# Altium project YW_001.PrjPcb
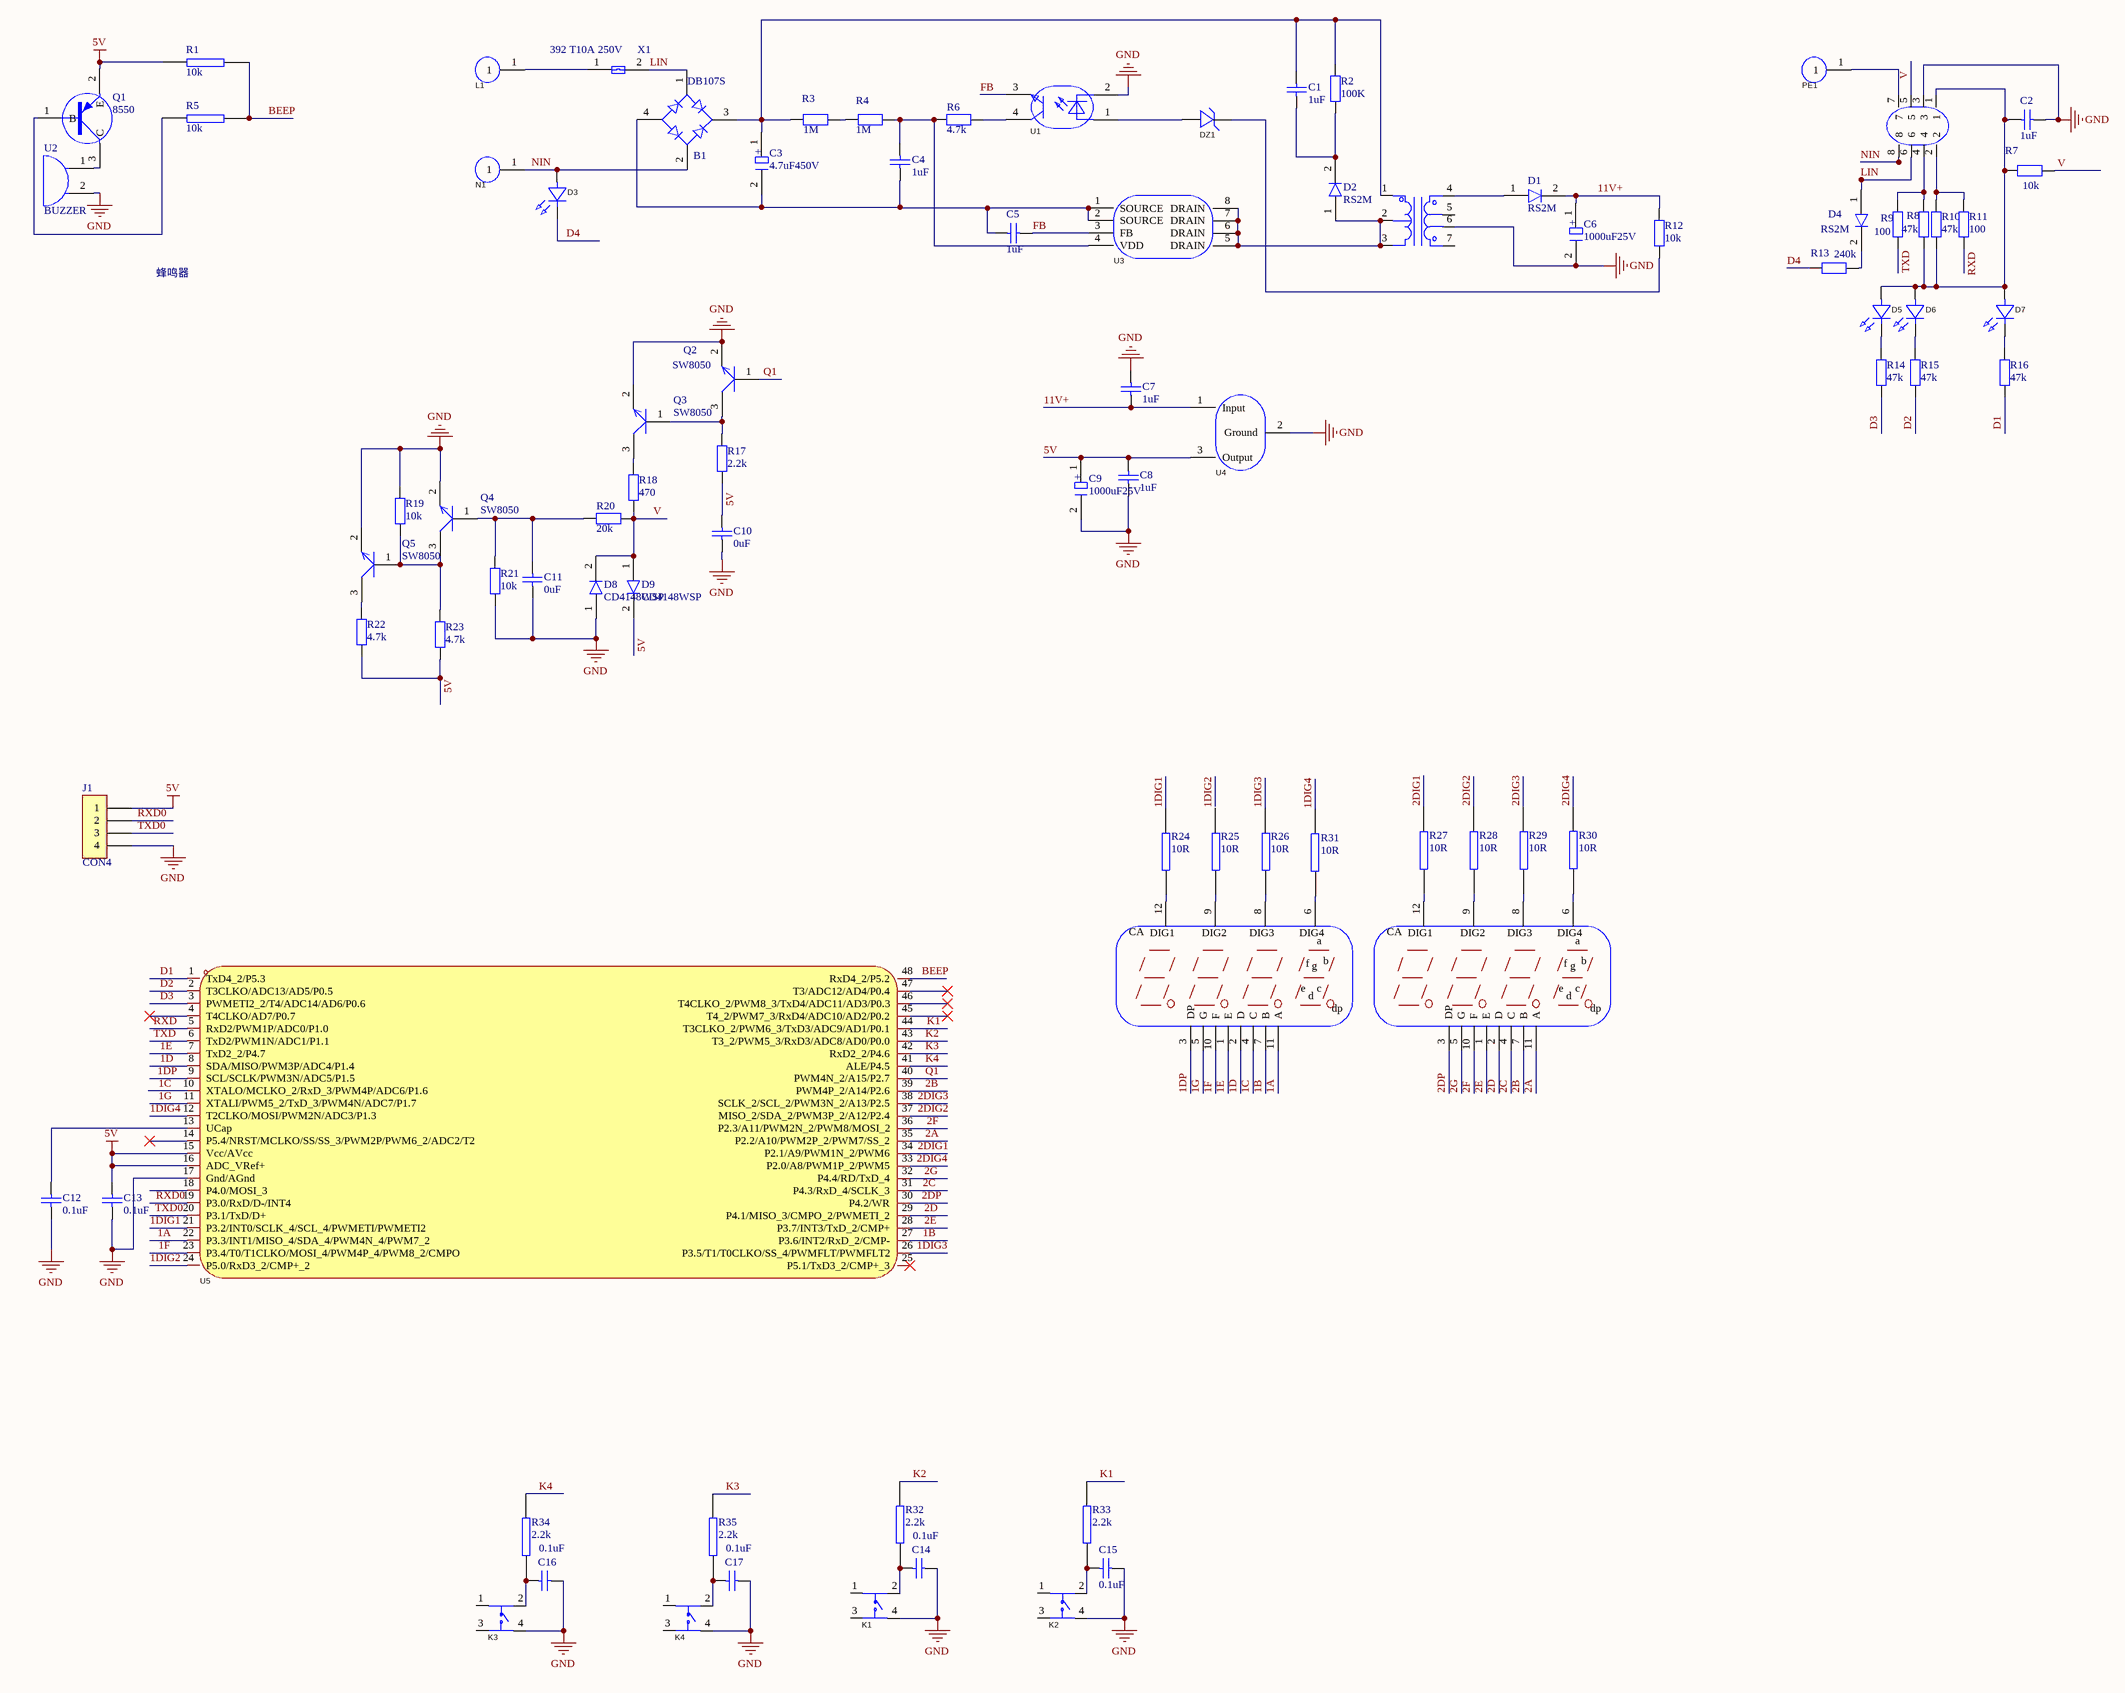
[diagram p0: YW_001.SchDoc]
1 sheet, 86 parts. Net scope: global (net labels, ports and power ports of the same name join across sheets).
Board file: YW_001.PcbDoc

## Sheet YW_001.SchDoc
size A1

### Parts
B1  DB107S  [DB107S]
C1  value 1uF  [CAP-TH_L5.5-W4.0-P5.00-D0.5]  (hidden comment: 102)
C2  value 1uF  [0805C]  (hidden comment: 104P)
C3  4.7uF450V  [CAP-TH_BD6.3-P2.50-D1.0-FD]
C4  1uF  [0805C]
C5  value 1uF  [0805C]  (hidden comment: 104P)
C6  1000uF25V  [CAP-TH_BD10.0-P5.00-D1.0-FD]
C7  value 1uF  [0805C]  (hidden comment: 102)
C8  1uF  [0805C]
C9  1000uF25V  [CAP-TH_BD10.0-P5.00-D1.0-FD]
C10  value 0uF  [0805C]  (hidden comment: 102)
C11  value 0uF  [0805C]  (hidden comment: 102)
C12  value 0.1uF  [C0603]  (hidden comment: 104P)
C13  value 0.1uF  [C0603]  (hidden comment: 104P)
C14  value 0.1uF  [0805C]  (hidden comment: 104P)
C15  value 0.1uF  [0805C]  (hidden comment: 104P)
C16  value 0.1uF  [0805C]  (hidden comment: 104P)
C17  value 0.1uF  [0805C]  (hidden comment: 104P)
D1  RS2M  [SMA-SMD_L4.4-W2.7-LS5.4-RD]
D2  RS2M  [SMA-SMD_L4.4-W2.7-LS5.4-RD]
D3  HLMP-1503-D0000  [LED-TH_BD3.0-P2.54-RD]  (value not drawn)
D4  RS2M  [SMA-SMD_L4.4-W2.7-LS5.4-RD]
D5  HLMP-1503-D0000  [LED-TH_BD3.0-P2.54-RD]  (value not drawn)
D6  HLMP-1503-D0000  [LED-TH_BD3.0-P2.54-RD]  (value not drawn)
D7  HLMP-1503-D0000  [LED-TH_BD3.0-P2.54-RD]  (value not drawn)
D8  CD4148WSP  [D0805-RD]
D9  CD4148WSP  [D0805-RD]
DZ1  ZMM24  [LL-34_L3.5-W1.5-RD]  (value not drawn)
H1  HC-5557-2*4AW  [CONN-TH_8P-P4.20_5557-2X4AW]  (value not drawn)
J1  CON4  [HDR1X4]
K1  TS1212TPFS 250gf 072  [KEY-SMD_4P-L12.0-W12.0-P5.00-LS15.0]  (value not drawn)
K2  TS1212TPFS 250gf 072  [KEY-SMD_4P-L12.0-W12.0-P5.00-LS15.0]  (value not drawn)
K3  TS1212TPFS 250gf 072  [KEY-SMD_4P-L12.0-W12.0-P5.00-LS15.0]  (value not drawn)
K4  TS1212TPFS 250gf 072  [KEY-SMD_4P-L12.0-W12.0-P5.00-LS15.0]  (value not drawn)
L1  PZ254V-11-01P  [HDR-TH_1P-P2.54-V-M]  (value not drawn)
LED1  FJ5461BH 橙红  [LED-SEG-TH_FJ5461AH]  (value not drawn)
LED2  FJ5461BH 橙红  [LED-SEG-TH_FJ5461AH]  (value not drawn)
N1  PZ254V-11-01P  [HDR-TH_1P-P2.54-V-M]  (value not drawn)
PE1  PZ254V-11-01P  [HDR-TH_1P-P2.54-V-M]  (value not drawn)
Q1  8550  [SOT-23]
Q2  SW8050  [SOT-23 - S8550]
Q3  SW8050  [SOT-23 - S8550]
Q4  SW8050  [SOT-23 - S8550]
Q5  SW8050  [SOT-23 - S8550]
R1  10k  [0805]
R2  value 100K  [0805]  (hidden comment: Res2)
R3  value 1M  [0805]  (hidden comment: Res2)
R4  value 1M  [0805]  (hidden comment: Res2)
R5  10k  [0805]
R6  value 4.7k  [0805]  (hidden comment: Res2)
R7  value 10k  [0805]  (hidden comment: Res2)
R8  value 47k  [0805]  (hidden comment: Res2)
R9  value 100  [0805]  (hidden comment: Res2)
R10  value 47k  [0805]  (hidden comment: Res2)
R11  value 100  [0805]  (hidden comment: Res2)
R12  value 10k  [0805]  (hidden comment: Res2)
R13  value 240k  [0805]  (hidden comment: Res2)
R14  value 47k  [0805]  (hidden comment: Res2)
R15  value 47k  [0805]  (hidden comment: Res2)
R16  value 47k  [0805]  (hidden comment: Res2)
R17  value 2.2k  [0805]  (hidden comment: Res2)
R18  value 470  [0805]  (hidden comment: Res2)
R19  value 10k  [0805]  (hidden comment: Res2)
R20  value 20k  [0805]  (hidden comment: Res2)
R21  value 10k  [0805]  (hidden comment: Res2)
R22  value 4.7k  [0805]  (hidden comment: Res2)
R23  value 4.7k  [0805]  (hidden comment: Res2)
R24  10R  [R0603]
R25  10R  [R0603]
R26  10R  [R0603]
R27  10R  [R0603]
R28  10R  [R0603]
R29  10R  [R0603]
R30  10R  [R0603]
R31  10R  [R0603]
R32  2.2k  [0805]
R33  2.2k  [0805]
R34  2.2k  [0805]
R35  2.2k  [0805]
U1  EL817S1(C)(TU)-F  [OPTO-SMD-4_L4.6-W6.5-P2.54-LS10.3-TL]  (value not drawn)
U2  BUZZER  [BUZZ-7.6/12]
U3  VIPER12ASTR-E  [SOIC-8_L5.0-W4.0-P1.27-LS6.0-BL]  (value not drawn)
U4  MC7805CDTRKG  [TO-252-2_L6.6-W6.1-P4.58-LS9.9-TL]  (value not drawn)
U5  STC8H8K64U-45I-LQFP48  [LQFP-48_L7.0-W7.0-P0.50-LS9.0-BL]  (value not drawn)
USB1  ECO2017SEO-X16V015  [XFMR-TH_ECO2017SEO-X16V015]  (value not drawn)
X1  392 T10A 250V  [FUSE]

### Nets
5V: C8.1 C9.1 C10.1 C13.2 D9.2 J1.1 Q1.2(E) R1.1 R17.2 R22.2 R23.2 U4.3(Output) U5.15(Vcc/AVcc) U5.16(ADC_VRef+)
GND: C2.1 C6.2 C7.1 C8.2 C9.2 C10.2 C11.2 C12.1 C13.1 C14.2 C15.2 C16.2 C17.2 D8.1 H1.3 J1.4 K1.4 K2.4 K3.4 K4.4 Q2.2(E) Q3.2(E) Q4.2(E) Q5.2(E) R19.1 R21.1 U1.2(CAT) U2.2(B) U4.2(Ground) U5.17(Gnd/AGnd) USB1.6
1A: LED1.11(A) U5.22(P3.3/INT1/MISO_4/SDA_4/PWM4N_4/PWM7_2)
1B: LED1.7(B) U5.27(P3.6/INT2/RxD_2/CMP-)
1C: LED1.4(C) U5.10(XTALO/MCLKO_2/RxD_3/PWM4P/ADC6/P1.6)
1D: LED1.2(D) U5.8(SDA/MISO/PWM3P/ADC4/P1.4)
1DIG1: R24.1 U5.21(P3.2/INT0/SCLK_4/SCL_4/PWMETI/PWMETI2)
1DIG2: R25.1 U5.24(P5.0/RxD3_2/CMP+_2)
1DIG3: R26.1 U5.26(P3.5/T1/T0CLKO/SS_4/PWMFLT/PWMFLT2)
1DIG4: R31.2 U5.12(T2CLKO/MOSI/PWM2N/ADC3/P1.3)
1DP: LED1.3(DP) U5.9(SCL/SCLK/PWM3N/ADC5/P1.5)
1E: LED1.1(E) U5.7(TxD2_2/P4.7)
1F: LED1.10(F) U5.23(P3.4/T0/T1CLKO/MOSI_4/PWM4P_4/PWM8_2/CMPO)
1G: LED1.5(G) U5.11(XTALI/PWM5_2/TxD_3/PWM4N/ADC7/P1.7)
2A: LED2.11(A) U5.35(P2.2/A10/PWM2P_2/PWM7/SS_2)
2B: LED2.7(B) U5.39(PWM4P_2/A14/P2.6)
2C: LED2.4(C) U5.31(P4.3/RxD_4/SCLK_3)
2D: LED2.2(D) U5.29(P4.1/MISO_3/CMPO_2/PWMETI_2)
2DIG1: R27.1 U5.34(P2.1/A9/PWM1N_2/PWM6)
2DIG2: R28.1 U5.37(MISO_2/SDA_2/PWM3P_2/A12/P2.4)
2DIG3: R29.1 U5.38(SCLK_2/SCL_2/PWM3N_2/A13/P2.5)
2DIG4: R30.2 U5.33(P2.0/A8/PWM1P_2/PWM5)
2DP: LED2.3(DP) U5.30(P4.2/WR)
2E: LED2.1(E) U5.28(P3.7/INT3/TxD_2/CMP+)
2F: LED2.10(F) U5.36(P2.3/A11/PWM2N_2/PWM8/MOSI_2)
2G: LED2.5(G) U5.32(P4.4/RD/TxD_4)
11V+: C6.1 C7.2 D1.2 R12.1 U4.1(Input)
BEEP: R1.2 R5.2 U5.48(RxD4_2/P5.2)
D1: R16.2 U5.1(TxD4_2/P5.3)
D2: R15.2 U5.2(T3CLKO/ADC13/AD5/P0.5)
D3: R14.2 U5.3(PWMETI2_2/T4/ADC14/AD6/P0.6)
D4: D3.1(K) R13.2
FB: C5.1 U1.3(EM) U3.3(FB)
K1: R33.2 U5.44(T3CLKO_2/PWM6_3/TxD3/ADC9/AD1/P0.1)
K2: R32.2 U5.43(T3_2/PWM5_3/RxD3/ADC8/AD0/P0.0)
K3: R35.2 U5.42(RxD2_2/P4.6)
K4: R34.2 U5.41(ALE/P4.5)
LIN: B1.1 D4.1 H1.6 X1.2
NIN: B1.2 D3.2(A) H1.8 N1.1
Q1: Q2.1(B) U5.40(PWM4N_2/A15/P2.7)
RXD: R11.1 U5.5(RxD2/PWM1P/ADC0/P1.0)
RXD0: J1.2 U5.19(P3.0/RxD/D-/INT4)
TXD: R9.1 U5.6(TxD2/PWM1N/ADC1/P1.1)
TXD0: J1.3 U5.20(P3.1/TxD/D+)
V: D8.2 D9.1 H1.5 R7.1 R18.2 R20.2
NetB1_3: B1.3 C1.1 C3.1 R2.1 R3.2 USB1.1
NetB1_4: B1.4 C3.2 C4.2 C5.2 U3.1(SOURCE) U3.2(SOURCE)
NetC1_2: C1.2 D2.2 R2.2
NetC2_2: C2.2 D5.2(A) D6.2(A) D7.2(A) H1.1 R7.2 R8.2 R10.2
NetC4_1: C4.1 R4.1 R6.2 U3.4(VDD)
NetC11_1: C11.1 Q4.1(B) R20.1 R21.2
NetC12_2: C12.2 U5.13(UCap)
NetC14_1: C14.1 K1.2 R32.1
NetC15_1: C15.1 K2.2 R33.1
NetC16_1: C16.1 K3.2 R34.1
NetC17_1: C17.1 K4.2 R35.1
NetD1_1: D1.1 USB1.4
NetD2_1: D2.1 U3.5(DRAIN) U3.6(DRAIN) U3.7(DRAIN) U3.8(DRAIN) USB1.2 USB1.3
NetD4_2: D4.2 R13.1
NetD5_1: D5.1(K) R14.1
NetD6_1: D6.1(K) R15.1
NetD7_1: D7.1(K) R16.1
NetDZ1_1: DZ1.1(C) R12.2
NetDZ1_2: DZ1.2(A) U1.1(AN)
NetH1_2: H1.2 R10.1 R11.2
NetH1_4: H1.4 R8.1 R9.2
NetH1_7: H1.7 PE1.1
NetL1_1: L1.1 X1.1
NetLED1_6: LED1.6(DIG4) R31.1
NetLED1_8: LED1.8(DIG3) R26.2
NetLED1_9: LED1.9(DIG2) R25.2
NetLED1_12: LED1.12(DIG1) R24.2
NetLED2_6: LED2.6(DIG4) R30.1
NetLED2_8: LED2.8(DIG3) R29.2
NetLED2_9: LED2.9(DIG2) R28.2
NetLED2_12: LED2.12(DIG1) R27.2
NetQ1_1: Q1.1(B) R5.1
NetQ1_3: Q1.3(C) U2.1(A)
NetQ2_3: Q2.3(C) Q3.1(B) R17.1
NetQ3_3: Q3.3(C) R18.1
NetQ4_3: Q4.3(C) Q5.1(B) R19.2 R23.1
NetQ5_3: Q5.3(C) R22.1
NetR3_1: R3.1 R4.2
NetR6_1: R6.1 U1.4(COL)

Not connected (* = marked no-connect by the designer): K1 1 3; K2 1 3; K3 1 3; K4 1 3; U5 4(T4CLKO/AD7/P0.7)* 14(P5.4/NRST/MCLKO/SS/SS_3/PWM2P/PWM6_2/ADC2/T2)* 18(P4.0/MOSI_3) 25(P5.1/TxD3_2/CMP+_3)* 45(T4_2/PWM7_3/RxD4/ADC10/AD2/P0.2)* 46(T4CLKO_2/PWM8_3/TxD4/ADC11/AD3/P0.3)* 47(T3/ADC12/AD4/P0.4)*; USB1 5(4) 7(1)

### Notes on the sheet
- 蜂鸣器
- (in symbol FJ5461BH 橙红) CA; a; f; b; g; e; c; d; dp
- (in symbol 电解电容) +

### Library data of the parts
B1 = 整流桥堆
C1 C2 C4 C5 C7 C8 C10-C17 = Cap: Capacitor; Published: 8-Jun-2000; LatestRevisionDate: 17-Jul-2002; LatestRevisionNote: Re-released for DXP Platform.; PackageReference: RAD-0.3; Publisher: Altium Limited; PackageDescription: Radial Cap, Thru-Hole; 2 Leads; 0.3 in Pin Spacing
  C4 C8: Value: 1uF
C3 = 电解电容
C6 C9 = 电解电容: CD2881081EM1017VFL
D1 D2 D4 D8 D9 = 二极管: pin to pad: 1>2 2>1
D3 D5-D7 = HLMP-1503-D0000: Manufacturer: Broadcom/AVAGO(安华高); Add into BOM: yes; Symbol: HLMP-1503-D0000; Device: HLMP-1503-D0000; LCSC Part Name: HLMP-1503-D0000; Supplier Part: C6795839; Manufacturer Part: HLMP-1503-D0000; Supplier Footprint: 插件; JLCPCB Part Class: Extended Part; Datasheet: https://atta.szlcsc.com/upload/public/pdf/source/20230602/8B2B82820B3183ED281EA59E7A8BD22E.pdf; Supplier: LCSC; Convert to PCB: yes
DZ1 = ZMM24_C7470923: Manufacturer: HXY MOSFET(华轩阳电子); Add into BOM: yes; Diode Configuration: 独立式; Zener Voltage (Nom): 24V; Reverse Leakage Current (Ir): 100nA@18V; Zener Voltage (Range): 22.8V~25.6V; Power Dissipation: 500mW; Zener Impedance (Zzt): 80Ω; Symbol: ZMM24_C7470923; Device: ZMM24_C7470923; LCSC Part Name: ZMM24; Supplier Part: C7470923; Manufacturer Part: ZMM24; Supplier Footprint: LL-34; JLCPCB Part Class: Extended Part; Datasheet: https://atta.szlcsc.com/upload/public/pdf/source/20230915/581C4D7CC1FE908B5D3501977E79B43B.pdf; Supplier: LCSC; Convert to PCB: yes
H1 = HC-5557-2*4AW: Manufacturer: HCTL(华灿天禄); Add into BOM: yes; Pins Structure: 2x4P; Pitch: 4.2mm; Number of PINs Per Row: 4; Current Rating (Max): 9A; Symbol: HC-5557-2*4AW; Device: HC-5557-2*4AW; LCSC Part Name: 2x4P 间距:4.2mm 弯插; Supplier Part: C2845789; Manufacturer Part: HC-5557-2*4AW; Supplier Footprint: 弯插,P=4.2mm; JLCPCB Part Class: Extended Part; Datasheet: https://atta.szlcsc.com/upload/public/pdf/source/20230620/3AA4118B2C2E81189EA8FE45B17A7E9B.pdf; Supplier: LCSC; Convert to PCB: yes; Mounting Style: 弯插; Reference Series: -; Number of Pins: 8P; Number of Rows: 2; Row Spacing: 4.2mm; Contact Material: 黄铜; Contact Plating: 锡; Operating Temperature Range: -25℃~+85℃
J1 = CON4: Connector
K1-K4 = TS1212TPFS 250gf 072: Manufacturer: SHOU HAN(首韩); Add into BOM: yes; Circuit: 单刀单掷; Actuator Style: 圆形按钮; Operating Force: 2.5N; Switch Length: 12mm; Switch Height: 1.2mm; Strike Gundam: 不带; Contact Current: 50mA; Voltage Rating (DC): 12V; Insulation Resistance: 100MΩ; Actuator/Cap Color: 黑色; Pin Style: 鸥翼型; Mechanical Life: 10万次; Symbol: TS1212TPFS 250GF 072; Device: TS1212TPFS 250gf 072; LCSC Part Name: 12*12*1.2mm 立贴 轻触开关; Supplier Part: C2858285; Manufacturer Part: TS1212TPFS 250gf 072; Supplier Footprint: SMD-4P,12x12mm; JLCPCB Part Class: Extended Part; Datasheet: https://atta.szlcsc.com/upload/public/pdf/source/20240530/61FBD9981DC96E206A7130E740881932.pdf; Supplier: LCSC; Convert to PCB: yes; Mounting Style: 立贴; Switch Width: 12mm; Operating Temperature: -20℃~+80℃
L1 = PZ254V-11-01P: Manufacturer: XFCN(兴飞); Add into BOM: yes; Pin Structure: 1x1P; Pitch: 2.54mm; Circluar Pins/Square Pins: 方针; Color: 黑色; Symbol: PZ254V-11-01P; Device: PZ254V-11-01P; LCSC Part Name: 间距:2.54mm 1x1P 直插 方针; Supplier Part: C492400; Manufacturer Part: PZ254V-11-01P; Supplier Footprint: 插件,P=2.54mm; JLCPCB Part Class: Extended Part; Datasheet: https://atta.szlcsc.com/upload/public/pdf/source/20200309/C492400_46876A5B545F5AE6B8D4A09C46E276E8.pdf; Supplier: LCSC; Convert to PCB: yes; Row Spacing: -; Mounting Type: 直插; Number of Rows: 单排; Number of Pins: 1P; Current Rating (Max): -; Voltage Rating (Max): -; Length of Mating Pin: 6mm; Insulation Height: 2.5mm; Length of End Connection Pin: 3mm; Contact Material: 黄铜; Contact Plating: -; Operating Temperature Range: -40℃~+105℃
LED1 LED2 = FJ5461BH 橙红: Manufacturer: 志浩; Symbol: FJ5461BH-red-orange; Add into BOM: yes; Number of Characters: 4位; Luminous Color: 红色; LED Polarity: 共阳极; Digit/Alpha Size(inch): 0.56; Device: FJ5461BH 橙红; LCSC Part Name: 4位0.56英寸红色数码管 共阳极; Supplier Part: C10713; Manufacturer Part: FJ5461BH 橙红; Supplier Footprint: 插件; JLCPCB Part Class: Extended Part; Datasheet: https://atta.szlcsc.com/upload/public/pdf/source/20121231/1457706574845.pdf; Supplier: LCSC; Convert to PCB: yes
N1 PE1 = PZ254V-11-01P: Manufacturer: XFCN(兴飞); Add into BOM: yes; Pin Structure: 1x1P; Pitch: 2.54mm; Circluar Pins/Square Pins: 方针; Symbol: PZ254V-11-01P; Device: PZ254V-11-01P; LCSC Part Name: 间距:2.54mm 1x1P 直插 方针; Supplier Part: C492400; Manufacturer Part: PZ254V-11-01P; Supplier Footprint: 插件,P=2.54mm; JLCPCB Part Class: Extended Part; Datasheet: https://atta.szlcsc.com/upload/public/pdf/source/20200309/C492400_46876A5B545F5AE6B8D4A09C46E276E8.pdf; Supplier: LCSC; Convert to PCB: yes; Row Spacing: -; Mounting Type: 直插; Number of Rows: 单排; Number of Pins: 1P; Current Rating (Max): -; Voltage Rating (Max): -; Length of Mating Pin: 6mm; Insulation Height: 2.5mm; Length of End Connection Pin: 3mm; Contact Material: 黄铜; Contact Plating: -; Operating Temperature Range: -40℃~+105℃; Color: 黑色
Q1 = PNP
Q2-Q5 = 普通三级管（NPN）
R1 R5 R24-R35 = RES2
R2-R4 R6-R23 = Res2: Resistor; Published: 8-Jun-2000; LatestRevisionDate: 17-Jul-2002; LatestRevisionNote: Re-released for DXP Platform.; PackageReference: AXIAL-0.4; Publisher: Altium Limited; PackageDescription: Axial Device, Thru-Hole; 2 Leads; 0.4 in Pin Spacing
U1 = EL817S1(C)(TU)-F: Manufacturer: EVERLIGHT(亿光); Add into BOM: yes; Input voltage type: DC; Output Type: 光电三极管; Forward Voltage: 1.2V; Output Current: 50mA; Isolation Voltage(rms): 5kV; Reverse Voltage: 6V; Load Voltage: 35V; Number of Outputs: 1; Collector-Emitter Saturation Voltage (Vce(sat)@Ic,IF): 100mV@1mA,20mA; Rise time: 18us@2mA,100Ω; Symbol: EL817S1(C)(TU)-F; Device: EL817S1(C)(TU)-F; LCSC Part Name: DC输入 隔离电压(rms):5000V; Supplier Part: C106900; Manufacturer Part: EL817S1(C)(TU)-F; Supplier Footprint: SMD-4P; JLCPCB Part Class: Basic Part; Datasheet: https://atta.szlcsc.com/upload/public/pdf/source/20181026/C323798_FBCE14484708FE0807B9A090D624C4F0.pdf; Supplier: LCSC; Convert to PCB: yes; Fall time: 18us@2mA,100Ω; Operating Temperature: -55℃~+110℃
U3 = VIPER12ASTR-E: Manufacturer: ST(意法半导体); Add into BOM: yes; Output Isolation: 非隔离; Supply Voltage: 9V~38V; Switching Frequency: 60kHz; Breakdown Voltage: 730V; Symbol: VIPER12ASTR-E; Device: VIPER12ASTR-E; LCSC Part Name: 低功耗离线开关模式电源主开关; Supplier Part: C7522; Manufacturer Part: VIPER12ASTR-E; Supplier Footprint: SOIC-8; JLCPCB Part Class: Extended Part; Datasheet: https://atta.szlcsc.com/upload/public/pdf/source/20140724/1457707166995.pdf; Supplier: LCSC; Convert to PCB: yes; Operating Temperature: -40℃~+150℃
U4 = MC7805CDTRKG: Manufacturer: onsemi(安森美); Add into BOM: yes; Output Type: 固定; Maximum Input Voltage: 35V; Output Voltage: 5V; MAX Output Current: 1A; Power Supply Rejection Ratio (PSRR): 83dB@(120Hz); Dropout Voltage: 2V@(1A); standby current: 6.5mA; Output Polarity: 正极; Number of Outputs: 1; Symbol: MC7805CDTRKG; Device: MC7805CDTRKG; LCSC Part Name: MC7805CDTRKG; Supplier Part: C54285; Manufacturer Part: MC7805CDTRKG; Supplier Footprint: TO-252-2(DPAK); JLCPCB Part Class: Extended Part; Datasheet: https://atta.szlcsc.com/upload/public/pdf/source/20181108/C327508_B78150FF97C8C38061229236786A5884.pdf; Supplier: LCSC; Convert to PCB: yes; Operating Temperature: 0℃~+125℃
U5 = STC8H8K64U-45I-LQFP48: Manufacturer: STC(宏晶); Add into BOM: yes; CPU Core: 51系列; Program Storage Size: 64KB; Program Memory Type: FLASH; Symbol: STC8H8K64U-45I-LQFP48; Device: STC8H8K64U-45I-LQFP48; LCSC Part Name: 宽电压/高速/高可靠/低功耗/强抗静电/较强抗干扰的新一代 8051 单片机; Supplier Part: C3013145; Manufacturer Part: STC8H8K64U-45I-LQFP48; Supplier Footprint: LQFP-48(7x7); JLCPCB Part Class: Extended Part; Datasheet: https://atta.szlcsc.com/upload/public/pdf/source/20230914/FE7F6A67FEB4E2D9A560A799C5B97078.pdf; Supplier: LCSC; Convert to PCB: yes; GPIO Ports Number: -; Operating Voltage Range: -; CPU Maximum Speed: -; ADC (Bit): -; DAC (Bit): -; PWM (Bit): -; Universal Serial Bus: -; Internal Comparator: -; communication protocol: -; Watchdog: -; Real-Time Clock: -; Infrared Data Association: -; Low-Voltage Detect: -; CCP Capture/Compare: -; Secure Digital Input and Output: -; Direct Memory Access: -; Internal Oscillator: -
USB1 = ECO2017SEO-X16V015: Manufacturer: TDK; Add into BOM: yes; Primary Winding: 三路; Secondary Winding: 两路; Symbol: ECO2017SEO-X16V015; Device: ECO2017SEO-X16V015; LCSC Part Name: ECO2017SEO-X16V015; Supplier Part: C2762803; Manufacturer Part: ECO2017SEO-X16V015; Supplier Footprint: 插件; JLCPCB Part Class: Extended Part; Datasheet: https://atta.szlcsc.com/upload/public/pdf/source/20210330/C2762803_0539F2D7383AC707985FED84B39ED265.pdf; Supplier: LCSC; Convert to PCB: yes; Primary Side Voltage: -; Secondary Side Voltage: -; Output Current: -; Power: -; Isolation Voltage: -
X1 = 保险丝